# EAGLE schematic rover (EAGLE 9.6.2)
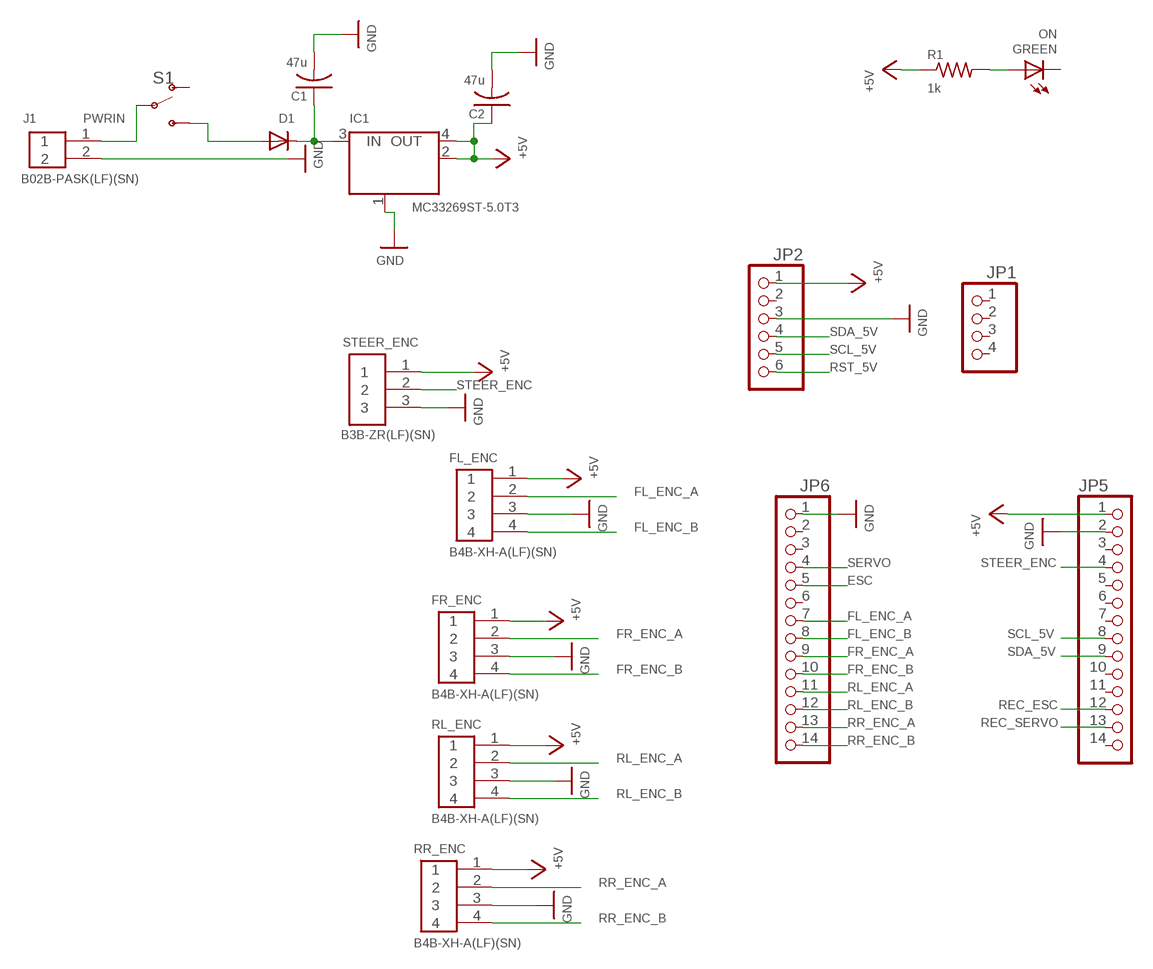
[diagram p0: schematic, sheet 1]

## Parts
C1  47u  C-USC1206  [C1206]
C2  47u  C-USC1206  [C1206]
D1  DIODESMA  [SMADIODE]
FL_ENC  B4B-XH-A(LF)(SN)  [B4B-XH-A(LF)(SN)]
FR_ENC  B4B-XH-A(LF)(SN)  [B4B-XH-A(LF)(SN)]
GREEN  ON  LEDCHIP-LED0805  [CHIP-LED0805]
IC1  MC33269ST-5.0T3  MC33269ST-3.3T3  [SOT223]
J1  B02B-PASK(LF)(SN)  [B02B-PASK(LF)(SN)]
JP1  PINHD-1X4  [1X04]
JP2  PINHD-1X6  [1X06]
JP5  PINHD-1X14  [1X14]
JP6  PINHD-1X14  [1X14]
R1  1k  R-US_R0603  [R0603]
RL_ENC  B4B-XH-A(LF)(SN)  [B4B-XH-A(LF)(SN)]
RR_ENC  B4B-XH-A(LF)(SN)  [B4B-XH-A(LF)(SN)]
S1  SWITCH-SPDT-SMD-AYZ0202  [SWITCH_DPDT_SMD_AYZ0202]
STEER_ENC  B3B-ZR(LF)(SN)  [B3B-ZR(LF)(SN)]

## Nets
+5V: C2.1 FL_ENC.1 FR_ENC.1 IC1.2(OUT) IC1.4(OUT) JP2.1 JP5.1 R1.1 RL_ENC.1 RR_ENC.1 STEER_ENC.1
ESC: JP6.5
FL_ENC_A: FL_ENC.2 JP6.7
FL_ENC_B: FL_ENC.4 JP6.8
FR_ENC_A: FR_ENC.2 JP6.9
FR_ENC_B: FR_ENC.4 JP6.10
GND: C1.2 C2.2 FL_ENC.3 FR_ENC.3 IC1.1(GND/ADJ) J1.2 JP2.3 JP5.2 JP6.1 RL_ENC.3 RR_ENC.3 STEER_ENC.3
N$1: GREEN.A R1.2
N$2: C1.1 D1.C IC1.3(IN)
N$3: D1.A S1.3(S)
PWRIN: J1.1 S1.2(P)
REC_ESC: JP5.12
REC_SERVO: JP5.13
RL_ENC_A: JP6.11 RL_ENC.2
RL_ENC_B: JP6.12 RL_ENC.4
RR_ENC_A: JP6.13 RR_ENC.2
RR_ENC_B: JP6.14 RR_ENC.4
RST_5V: JP2.6
SCL_5V: JP2.5 JP5.8
SDA_5V: JP2.4 JP5.9
SERVO: JP6.4
STEER_ENC: JP5.4 STEER_ENC.2
Unconnected: GREEN.C JP1.1 JP1.2 JP1.3 JP1.4 JP2.2 JP5.3 JP5.5 JP5.6 JP5.7 JP5.10 JP5.11 JP5.14 JP6.2 JP6.3 JP6.6 S1.1(O)

## Library data of the parts
C1 C2 = adafruit:C-US: CAPACITOR, American symbol
D1 = adafruit:DIODE: Diode SMADIODE - SMA Surface Mount Package 20V 1A Schottky Diode Digikey: 641-1014-6-ND DO-1N4148 - Through Hole Small Current Diode SOD-123 20V 1 A (.5mV Vf) Schottky Diode - Digikey: MBRX120TPMSCT-ND SOD-323 10V 570mA (.38mV Vf, 3ns) Schottky Diode - Digikey: ZLLS410CT-ND SOD-523 30V 30mA Schottky Diode (RB751S-40TE61) - Digikey: RB751S-40TE61CT-ND SOT23-R/W - SOT23 Package (R = Solder Paste/Reflow Ovens, W = Hand-Soldering) BAT54Film 40V 300mA - Digikey: 497-7162-1-ND
FL_ENC FR_ENC RL_ENC RR_ENC = Headers:B4B-XH-A(LF)(SN): CONN HEADER VERT 4POS 2.5MM Manufacturer's datasheet <http://www.jst-mfg.com/product/pdf/eng/eXH.pdf>; CREATED_BY: PCBLayout.com; DIGIKEY_PARTNO: 455-2249-ND; MANUFACTURER: JST Sales America Inc.; MPN: B4B-XH-A(LF)(SN)
GREEN = adafruit:LED: LED OSRAM: - CHIPLED LG R971, LG N971, LY N971, LG Q971, LY Q971, LO R971, LY R971 LH N974, LH R974 LS Q976, LO Q976, LY Q976 LO Q996 - Hyper CHIPLED LW Q18S LB Q993, LB Q99A, LB R99A - SideLED LS A670, LO A670, LY A670, LG A670, LP A670 LB A673, LV A673, LT A673, LW A673 LH A674 LY A675 LS A676, LA A676, LO A676, LY A676, LW A676 LS A679, LY A679, LG A679 - Hyper Micro SIDELED® LS Y876, LA Y876, LO Y876, LY Y876 LT Y87S - SmartLED LW L88C, LW L88S LB L89C, LB L89S, LG L890 LS L89K, LO L89K, LY L89K LS L896, LA L896, LO L896, LY L896 - TOPLED LS T670, LO T670, LY T670, LG T670, LP T670 LSG T670, LSP T670, LSY T670, LOP T670, LYG T670 LG T671, LOG T671, LSG T671 LB T673, LV T673, LT T673, LW T673 LH T674 LS T676, LA T676, LO T676, LY T676, LB T676, LH T676, LSB T676, LW T676 LB T67C, LV T67C, LT T67C, LS T67K, LO T67K, LY T67K, LW E67C LS E67B, LA E67B, LO E67B, LY E67B, LB E67C, LV E67C, LT E67C LW T67C LS T679, LY T679, LG T679 LS T770, LO T770, LY T770, LG T770, LP T770 LB T773, LV T773, LT T773, LW T773 LH T774 LS E675, LA E675, LY E675, LS T675 LS T776, LA T776, LO T776, LY T776, LB T776 LHGB T686 LT T68C, LB T68C - Hyper Mini TOPLED® LB M676 - Mini TOPLED Santana® LG M470 LS M47K, LO M47K, LY M47K Source: http://www.osram.convergy.de/
IC1 = linear:MC33269ST*: Adjustable Output Low Dropout Voltage Regulator 800 mA Source: http://www.onsemi.com/pub/Collateral/MC33269-D.PDF
J1 = Headers:B02B-PASK(LF)(SN): CONN HEADER VERT 2POS 2MM Manufacturer's datasheet <http://www.jst-mfg.com/product/pdf/eng/ePA-F.pdf>; CREATED_BY: PCBLayout.com; DIGIKEY_PARTNO: 455-1817-ND; MANUFACTURER: JST Sales America Inc.; MPN: B02B-PASK(LF)(SN)
JP1 = pinhead:PINHD-1X4: PIN HEADER
JP2 = pinhead:PINHD-1X6: PIN HEADER
JP5 JP6 = pinhead:PINHD-1X14: PIN HEADER
R1 = adafruit:R-US_: RESISTOR, American symbol
S1 = SparkFun-Switches:SWITCH-SPDT: Single Pole, Double Throw (SPDT) Switch Single-pole, double-throw (SPDT) switch. Variant Overview SMD-AYZ0202 Surface Mount DPDT Switch <https://www.sparkfun.com/products/597> (COM-00597) Used on e.g. LilyPad Arduino USB - ATmega32U4 Board <https://www.sparkfun.com/products/12049> PTH-11.6X4.0MM SPDT Mini Power Switch <https://www.sparkfun.com/products/102> (COM-00102) Used on e.g. SparkFun Simon Says - Through-Hole Soldering Kit <https://www.sparkfun.com/products/10547> (KIT-10547) PTH-11.6X4.0MM-KIT KIT version of SPDT Mini Power Switch - Simplifies soldering by removing tStop of switch pins - only one side can be soldered. PTH-11.6X4.0MM-LOCK LOCK version of SPDT Mini Power Switch - Offset pins hold switch in place for easier soldering. SMD-RIGHT-ANGLE Surface Mount Right Angle Switch <https://www.sparkfun.com/products/10860> (COM-10860) Used on e.g. SparkFun ESP8266 Thing <https://www.sparkfun.com/products/13231>; PROD_ID: SWCH-08179; SF_ID: COM-00597
STEER_ENC = Headers:B3B-ZR(LF)(SN): CONN HEADER VERT 3POS 1.5MM Manufacturer's datasheet <http://www.jst-mfg.com/product/pdf/eng/eZH.pdf>; CREATED_BY: PCBLayout.com; DIGIKEY_PARTNO: 455-1658-ND; MANUFACTURER: JST Sales America Inc.; MPN: B3B-ZR(LF)(SN)